# Altium project obc-db.PrjPcb
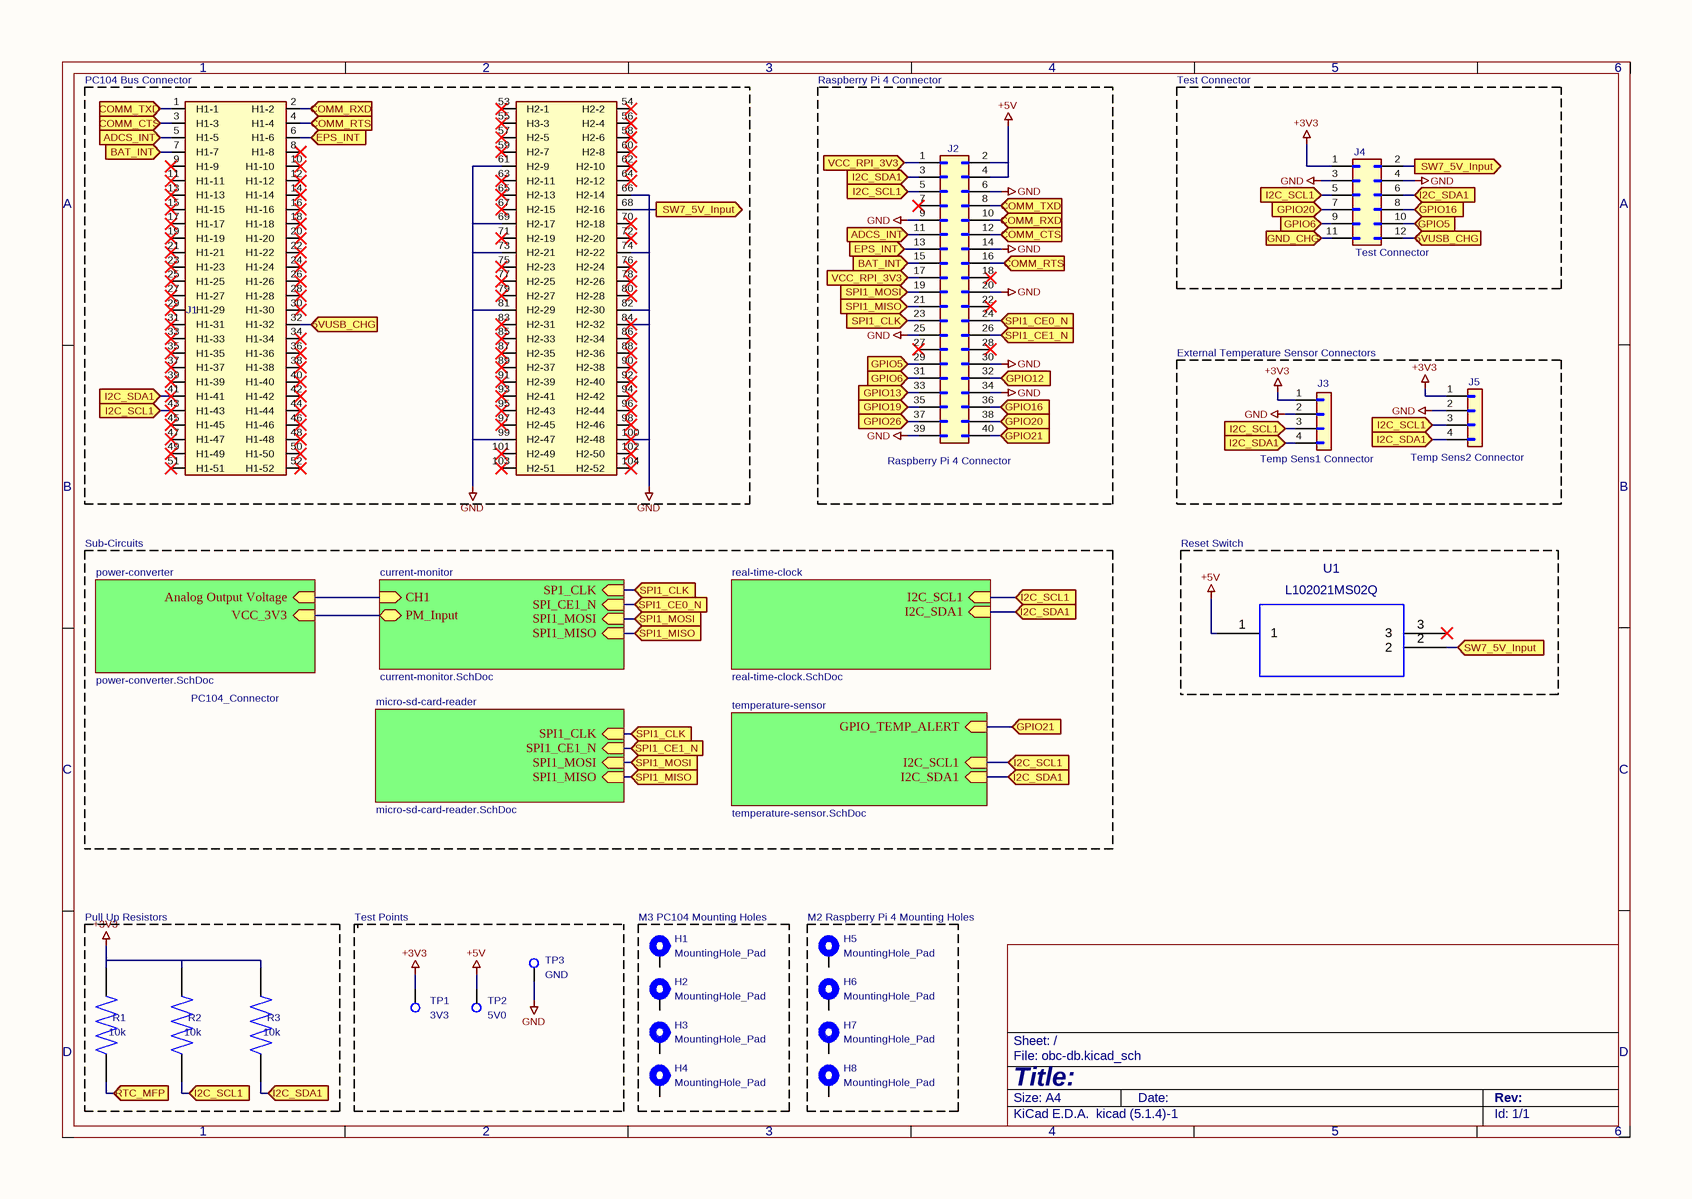
[diagram p0: obc-db.SchDoc]
6 sheets, 55 parts. Net scope: hierarchical (ports join the sheet entries above them; power ports are global).
Board files: obc-db.PcbDoc, obc-db(1).PcbDoc
Sheets:
  obc-db.SchDoc
    micro-sd-card-reader = micro-sd-card-reader.SchDoc
    power-converter = power-converter.SchDoc
    current-monitor = current-monitor.SchDoc
    real-time-clock = real-time-clock.SchDoc
    temperature-sensor = temperature-sensor.SchDoc

## Sheet obc-db.SchDoc
size 297 x 209 mm

### Parts
H1  MountingHole_Pad  [MountingHole_3.2mm_M3_Pad_TopBottom]
H2  MountingHole_Pad  [MountingHole_3.2mm_M3_Pad_TopBottom]
H3  MountingHole_Pad  [MountingHole_3.2mm_M3_Pad_TopBottom]
H4  MountingHole_Pad  [MountingHole_3.2mm_M3_Pad_TopBottom]
H5  MountingHole_Pad  [MountingHole_2.2mm_M2_Pad_TopBottom]
H6  MountingHole_Pad  [MountingHole_2.2mm_M2_Pad_TopBottom]
H7  MountingHole_Pad  [MountingHole_2.2mm_M2_Pad_TopBottom]
H8  MountingHole_Pad  [MountingHole_2.2mm_M2_Pad_TopBottom]
J1  PC104_Connector  [pc104-connector]
J2  Raspberry Pi 4 Connector  [PinSocket_2x20_P2.54mm_Vertical]
J3  Temp Sens1 Connector  [PinHeader_1x04_P2.54mm_Vertical]
J4  Test Connector  [PinSocket_2x06_P2.54mm_Horizontal]
J5  Temp Sens2 Connector  [PinHeader_1x04_P2.54mm_Vertical]
R1  10k  [R_0603_1608Metric]
R2  10k  [R_0603_1608Metric]
R3  10k  [R_0603_1608Metric]
TP1  3V3  [TestPoint_Pad_2.0x2.0mm]
TP2  5V0  [TestPoint_Pad_2.0x2.0mm]
TP3  GND  [TestPoint_Pad_2.0x2.0mm]
U1  L102021MS02Q  [L102021MS02Q]

### Blocks framed on the sheet
PC104 Bus Connector: J1
Test Connector: J4
External Temperature Sensor Connectors /: J3 J5
Reset Switch: U1
Pull Up Resistors: R1-R3
Test Points: TP1-TP3
M3 PC104 Mounting Holes /: H1-H4
M2 Raspberry Pi 4 Mounting Holes /: H5-H8

### Sub-sheets
current-monitor = current-monitor.SchDoc: CH1 (in), SPI1_MISO (in), SPI1_MOSI (in), SPI_CE1_N (in), SP1_CLK (in), PM_Input (bidir)
micro-sd-card-reader = micro-sd-card-reader.SchDoc: SPI1_CLK (in), SPI1_MOSI (in), SPI1_MISO (in), SPI1_CE1_N (in)
power-converter = power-converter.SchDoc: Analog Output Voltage (in), VCC_3V3 (in)
real-time-clock = real-time-clock.SchDoc: I2C_SCL1 (in), I2C_SDA1 (in)
temperature-sensor = temperature-sensor.SchDoc: GPIO_TEMP_ALERT (in), I2C_SDA1 (in), I2C_SCL1 (in)

### Ports
5VUSB_CHG (in), ADCS_INT (in), BAT_INT (in), COMM_CTS (in), COMM_RTS (in), COMM_RXD (in), COMM_TXD (in), EPS_INT (in), GND_CHG (in), GPIO5 (in), GPIO6 (in), GPIO12 (in), GPIO13 (in), GPIO16 (in), GPIO19 (in), GPIO20 (in), GPIO21 (in), GPIO26 (in), I2C_SCL1 (in), I2C_SDA1 (in), RTC_MFP (in), SPI1_CE0_N (in), SPI1_CE1_N (in), SPI1_CLK (in), SPI1_MISO (in), SPI1_MOSI (in), SW7_5V_Input (in), SW7_5V_Input (out), VCC_RPI_3V3 (in)

### Nets
+3V3: J3.1(Pin_1) J4.1(Pin_1) J5.1(Pin_1) R1.1 R2.1 R3.1 TP1.1
+5V: J2.2(Pin_2) J2.4(Pin_4) TP2.1 U1.1
GND: J1.61(H2-9) J1.66(H2-14) J1.69(H2-17) J1.73(H2-21) J1.74(H2-22) J1.81(H2-29) J1.82(H2-30) J1.84(H2-32) J1.99(H2-47) J1.100(H2-48) J2.6(Pin_6) J2.9(Pin_9) J2.14(Pin_14) J2.20(Pin_20) J2.25(Pin_25) J2.30(Pin_30) J2.34(Pin_34) J2.39(Pin_39) J3.2(Pin_2) J4.3(Pin_3) J4.4(Pin_4) J5.2(Pin_2) TP3.1
5VUSB_CHG: J1.32(H1-32) J4.12(Pin_12) ; port 5VUSB_CHG
ADCS_INT: J1.5(H1-5) J2.11(Pin_11) ; port ADCS_INT
Analog Output Voltage: sheet power-converter/Analog Output Voltage, sheet current-monitor/CH1
BAT_INT: J1.7(H1-7) J2.15(Pin_15) ; port BAT_INT
COMM_CTS: J1.3(H1-3) J2.12(Pin_12) ; port COMM_CTS
COMM_RTS: J1.4(H1-4) J2.16(Pin_16) ; port COMM_RTS
COMM_RXD: J1.2(H1-2) J2.10(Pin_10) ; port COMM_RXD
COMM_TXD: J1.1(H1-1) J2.8(Pin_8) ; port COMM_TXD
EPS_INT: J1.6(H1-6) J2.13(Pin_13) ; port EPS_INT
GND_CHG: J4.11(Pin_11) ; port GND_CHG
GPIO5: J2.29(Pin_29) J4.10(Pin_10) ; port GPIO5
GPIO6: J2.31(Pin_31) J4.9(Pin_9) ; port GPIO6
GPIO12: J2.32(Pin_32) ; port GPIO12
GPIO13: J2.33(Pin_33) ; port GPIO13
GPIO16: J2.36(Pin_36) J4.8(Pin_8) ; port GPIO16
GPIO19: J2.35(Pin_35) ; port GPIO19
GPIO20: J2.38(Pin_38) J4.7(Pin_7) ; port GPIO20
GPIO21: J2.40(Pin_40) ; port GPIO21, sheet temperature-sensor/GPIO_TEMP_ALERT
GPIO26: J2.37(Pin_37) ; port GPIO26
I2C_SCL1: J1.43(H1-43) J2.5(Pin_5) J3.3(Pin_3) J4.5(Pin_5) J5.3(Pin_3) R2.2 ; port I2C_SCL1, sheet real-time-clock/I2C_SCL1, sheet temperature-sensor/I2C_SCL1
I2C_SDA1: J1.41(H1-41) J2.3(Pin_3) J3.4(Pin_4) J4.6(Pin_6) J5.4(Pin_4) R3.2 ; port I2C_SDA1, sheet real-time-clock/I2C_SDA1, sheet temperature-sensor/I2C_SDA1
PM_Input: sheet power-converter/VCC_3V3, sheet current-monitor/PM_Input
RTC_MFP: R1.2 ; port RTC_MFP
SP1_CLK: J2.23(Pin_23) ; port SPI1_CLK, sheet micro-sd-card-reader/SPI1_CLK, sheet current-monitor/SP1_CLK
SPI1_CE0_N: J2.24(Pin_24) ; port SPI1_CE0_N, sheet current-monitor/SPI_CE1_N
SPI1_CE1_N: J2.26(Pin_26) ; port SPI1_CE1_N, sheet micro-sd-card-reader/SPI1_CE1_N
SPI1_MISO: J2.21(Pin_21) ; port SPI1_MISO, sheet micro-sd-card-reader/SPI1_MISO, sheet current-monitor/SPI1_MISO
SPI1_MOSI: J2.19(Pin_19) ; port SPI1_MOSI, sheet micro-sd-card-reader/SPI1_MOSI, sheet current-monitor/SPI1_MOSI
SW7_5V_Input: J1.68(H2-16) J4.2(Pin_2) U1.2 ; port SW7_5V_Input
VCC_RPI_3V3: J2.1(Pin_1) J2.17(Pin_17) ; port VCC_RPI_3V3

Not connected (* = marked no-connect by the designer): H1 1; H2 1; H3 1; H4 1; H5 1; H6 1; H7 1; H8 1; J1 8(H1-8)* 9(H1-9)* 10(H1-10)* 11(H1-11)* 12(H1-12)* 13(H1-13)* 14(H1-14)* 15(H1-15)* 16(H1-16)* 17(H1-17)* 18(H1-18)* 19(H1-19)* 20(H1-20)* 21(H1-21)* 22(H1-22)* 23(H1-23)* 24(H1-24)* 25(H1-25)* 26(H1-26)* 27(H1-27)* 28(H1-28)* 29(H1-29)* 30(H1-30)* 31(H1-31)* 33(H1-33)* 34(H1-34)* 35(H1-35)* 36(H1-36)* 37(H1-37)* 38(H1-38)* 39(H1-39)* 40(H1-40)* 42(H1-42)* 44(H1-44)* 45(H1-45)* 46(H1-46)* 47(H1-47)* 48(H1-48)* 49(H1-49)* 50(H1-50)* 51(H1-51)* 52(H1-52)* 53(H2-1)* 54(H2-2)* 55(H3-3)* 56(H2-4)* 57(H2-5)* 58(H2-6)* 59(H2-7)* 60(H2-8)* 62(H2-10)* 63(H2-11)* 64(H2-12)* 65(H2-13)* 67(H2-15)* 70(H2-18)* 71(H2-19)* 72(H2-20)* 75(H2-23)* 76(H2-24)* 77(H2-25)* 78(H2-26)* 79(H2-27)* 80(H2-28)* 83(H2-31)* 85(H2-33)* 86(H2-34)* 87(H2-35)* 88(H2-36)* 89(H2-37)* 90(H2-38)* 91(H2-39)* 92(H2-40)* 93(H2-41)* 94(H2-42)* 95(H2-43)* 96(H2-44)* 97(H2-45)* 98(H2-46)* 101(H2-49)* 102(H2-50)* 103(H2-51)* 104(H2-52)*; J2 7(Pin_7)* 18(Pin_18)* 22(Pin_22)* 27(Pin_27)* 28(Pin_28)*; U1 3*

### Notes on the sheet
- Raspberry Pi 4 Connector
- Sub-Circuits
- 1
- 2
- 3
- 4
- 5
- 6
- A
- B
- C
- D
- Title:
- File: obc-db.kicad_sch
- Sheet: /
- KiCad E.D.A.  kicad (5.1.4)-1
- Size: A4
- Date:
- Rev:
- Id: 1/1

### Library data of the parts
J1 = pc104-connector: Value: PC104_Connector; Footprint: pc104-template:pc104-connector
J2 = Conn_02x20_Odd_Even: Value: Raspberry Pi 4 Connector; Footprint: Connector_PinSocket_2.54mm:PinSocket_2x20_P2.54mm_Vertical
J3 J5 = Conn_01x04: Footprint: Connector_PinHeader_2.54mm:PinHeader_1x04_P2.54mm_Vertical
  J3: Value: Temp Sens1 Connector
  J5: Value: Temp Sens2 Connector
J4 = Conn_02x06_Odd_Even: Value: Test Connector; Footprint: Connector_PinSocket_2.54mm:PinSocket_2x06_P2.54mm_Horizontal
R1-R3 = ESR03EZPF1002: Value: 10k; Footprint: Resistor_SMD:R_0603_1608Metric
TP1-TP3 = TestPoint: Footprint: TestPoint:TestPoint_Pad_2.0x2.0mm
  TP1: Value: 3V3
  TP2: Value: 5V0
  TP3: Value: GND
H1-H8 = MountingHole_Pad: Value: MountingHole_Pad
  H1-H4: Footprint: MountingHole:MountingHole_3.2mm_M3_Pad_TopBottom
  H5-H8: Footprint: MountingHole:MountingHole_2.2mm_M2_Pad_TopBottom
U1 = L102021MS02Q: Value: L102021MS02Q; Footprint: qset-footprints:L102021MS02Q

## Sheet micro-sd-card-reader.SchDoc
size 297 x 209 mm
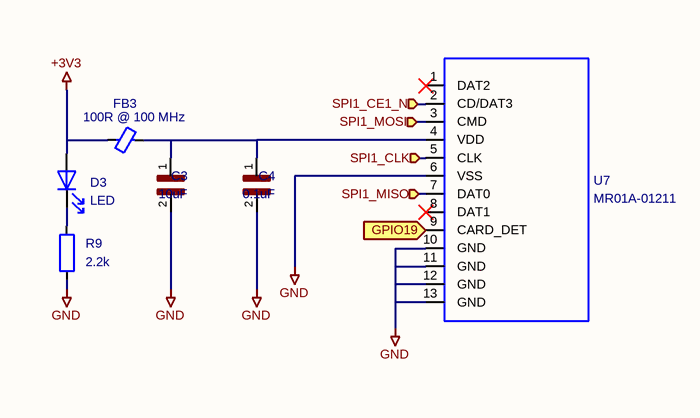
[diagram p1: micro-sd-card-reader.SchDoc]

### Parts
C3  10uF  [C_0603_1608Metric]
C4  0.1uF  [C_0603_1608Metric]
D3  LED  [LED_0603_1608Metric]
FB3  100R @ 100 MHz  [L_0603_1608Metric]
R9  2.2k  [R_0603_1608Metric]
U7  MR01A-01211  [MR01A-01211]

### Ports
GPIO19 (in), SPI1_CE1_N (in), SPI1_CLK (in), SPI1_MISO (in), SPI1_MOSI (in)

### Nets
+3V3: D3.2(A) FB3.1
GND: C3.2 C4.2 R9.2 U7.6(VSS) U7.10(GND) U7.11(GND) U7.12(GND) U7.13(GND)
GPIO19: U7.9(CARD_DET) ; port GPIO19
SP1_CLK: U7.5(CLK) ; port SPI1_CLK
SPI1_CE1_N: U7.2(CD/DAT3) ; port SPI1_CE1_N
SPI1_MISO: U7.7(DAT0) ; port SPI1_MISO
SPI1_MOSI: U7.3(CMD) ; port SPI1_MOSI
NetC3_1: C3.1 C4.1 FB3.2 U7.4(VDD)
NetD3_1: D3.1(K) R9.1

Not connected (* = marked no-connect by the designer): U7 1(DAT2)* 8(DAT1)*

### Notes on the sheet
- 1
- 2
- 3
- 4
- 5
- 6
- A
- B
- C
- D
- Title:
- File: micro-sd-card-reader.kicad_sch
- Sheet: /
- KiCad E.D.A.  kicad (5.1.4)-1
- Size: A4
- Date:
- Rev:
- Id: 1/1

### Library data of the parts
C3 C4 = CL10B104KB8NNNL: Footprint: Capacitor_SMD:C_0603_1608Metric
  C3: Value: 10uF
  C4: Value: 0.1uF
FB3 = FerriteBead_Small: Value: 100R @ 100 MHz; Footprint: Inductor_SMD:L_0603_1608Metric
R9 = R: Value: 2.2k; Footprint: Resistor_SMD:R_0603_1608Metric
D3 = LED: Value: LED; Footprint: LED_SMD:LED_0603_1608Metric
U7 = MR01A-01211: Value: MR01A-01211; Footprint: qset-footprints:MR01A-01211

## Sheet power-converter.SchDoc
size 297 x 209 mm
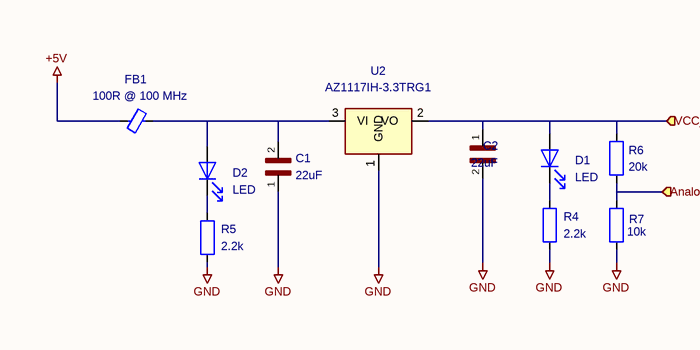
[diagram p2: power-converter.SchDoc]

### Parts
C1  22uF  [C_0603_1608Metric]
C2  22uF  [C_0603_1608Metric]
D1  LED  [LED_0603_1608Metric]
D2  LED  [LED_0603_1608Metric]
FB1  100R @ 100 MHz  [L_0603_1608Metric]
R4  2.2k  [R_0603_1608Metric]
R5  2.2k  [R_0603_1608Metric]
R6  20k  [R_0603_1608Metric]
R7  10k  [R_0603_1608Metric]
U2  AZ1117IH-3.3TRG1  [SOT-223-3_TabPin2]

### Ports
Analog Output Voltage (in), VCC_3V3 (in)

### Nets
+5V: FB1.2
GND: C1.1 C2.2 R4.2 R5.2 R7.2 U2.1(GND)
Analog Output Voltage: R6.2 R7.1 ; port Analog Output Voltage
PM_Input: C2.1 D1.2(A) R6.1 U2.2(VO) ; port VCC_3V3
NetC1_2: C1.2 D2.2(A) FB1.1 U2.3(VI)
NetD1_1: D1.1(K) R4.1
NetD2_1: D2.1(K) R5.1

### Notes on the sheet
- 1
- 2
- 3
- 4
- 5
- 6
- A
- B
- C
- D
- Title:
- File: power-converter.kicad_sch
- Sheet: /
- KiCad E.D.A.  kicad (5.1.4)-1
- Size: A4
- Date:
- Rev:
- Id: 1/1

### Library data of the parts
C1 C2 = CL10B104KB8NNNL: Value: 22uF; Footprint: Capacitor_SMD:C_0603_1608Metric
FB1 = FerriteBead_Small: Value: 100R @ 100 MHz; Footprint: Inductor_SMD:L_0603_1608Metric
R4-R7 = R: Footprint: Resistor_SMD:R_0603_1608Metric
  R4 R5: Value: 2.2k
  R6: Value: 20k
  R7: Value: 10k
U2 = AZ1117-3.3: Value: AZ1117IH-3.3TRG1; Footprint: Package_TO_SOT_SMD:SOT-223-3_TabPin2
D1 D2 = LED: Value: LED; Footprint: LED_SMD:LED_0603_1608Metric

## Sheet current-monitor.SchDoc
size 297 x 209 mm
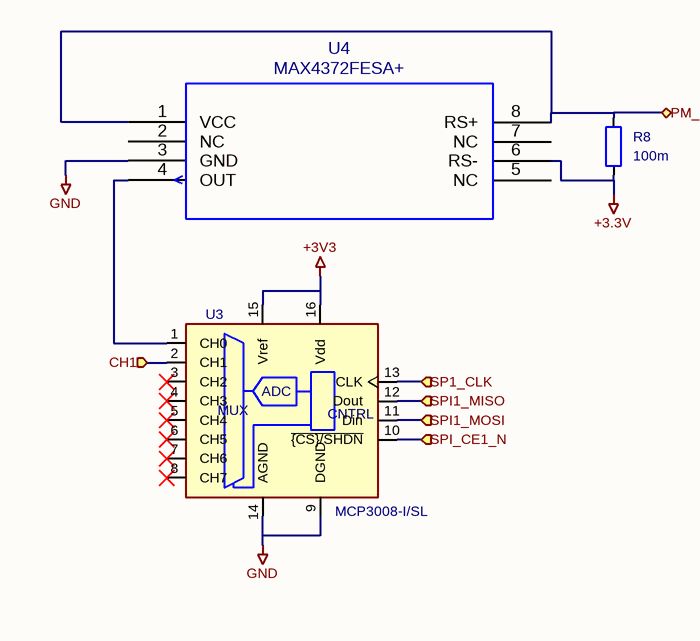
[diagram p3: current-monitor.SchDoc]

### Parts
R8  100m  [R_0402_1005Metric]
U3  MCP3008-I/SL  [Microchip-MCP3008-I_SL-Level_A]
U4  MAX4372FESA+  [Maxim-MAX4372FESA+-Level_A]

### Ports
CH1 (in), PM_Input (bidir), SP1_CLK (in), SPI1_MISO (in), SPI1_MOSI (in), SPI_CE1_N (in)

### Nets
+3.3V: R8.2 U4.6(RS-)
+3V3: U3.15(Vref) U3.16(Vdd)
GND: U3.9(DGND) U3.14(AGND) U4.3(GND)
Analog Output Voltage: U3.2(CH1) ; port CH1
PM_Input: R8.1 U4.1(VCC) U4.8(RS+) ; port PM_Input
SP1_CLK: U3.13(CLK) ; port SP1_CLK
SPI1_CE0_N: U3.10(~{{CS}/SHDN}) ; port SPI_CE1_N
SPI1_MISO: U3.12(Dout) ; port SPI1_MISO
SPI1_MOSI: U3.11(Din) ; port SPI1_MOSI
NetU3_1: U3.1(CH0) U4.4(OUT)

Not connected (* = marked no-connect by the designer): U3 3(CH2)* 4(CH3)* 5(CH4)* 6(CH5)* 7(CH6)* 8(CH7)*; U4 2(NC) 5(NC) 7(NC)

### Notes on the sheet
- 1
- 2
- 3
- 4
- 5
- 6
- A
- B
- C
- D
- Title:
- File: current-monitor.kicad_sch
- Sheet: /
- KiCad E.D.A.  kicad (5.1.4)-1
- Size: A4
- Date:
- Rev:
- Id: 1/1
- (in symbol MCP3008) ADC; MUX; CNTRL

### Library data of the parts
R8 = R: Value: 100m; Footprint: Resistor_SMD:R_0402_1005Metric
U3 = MCP3008: Value: MCP3008-I/SL; Footprint: qset-footprints:Microchip-MCP3008-I_SL-Level_A
U4 = MAX4372FESA+-MAX4372FESA+: Value: MAX4372FESA+; Footprint: qset-footprints:Maxim-MAX4372FESA+-Level_A

## Sheet real-time-clock.SchDoc
size 297 x 209 mm
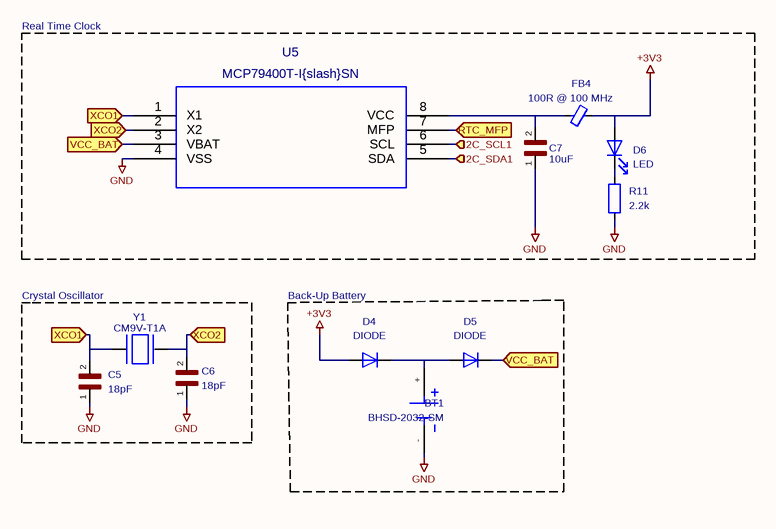
[diagram p4: real-time-clock.SchDoc]

### Parts
BT1  BHSD-2032-SM  [BAT_BHSD-2032-SM]
C5  18pF  [C_0603_1608Metric]
C6  18pF  [C_0603_1608Metric]
C7  10uF  [C_0603_1608Metric]
D4  DIODE  [D_0603_1608Metric]
D5  DIODE  [D_0603_1608Metric]
D6  LED  [LED_0603_1608Metric]
FB4  100R @ 100 MHz  [L_0603_1608Metric]
R11  2.2k  [R_0603_1608Metric]
U5  MCP79400T-I{slash}SN  [MCP79400T-I&slash_SN]
Y1  CM9V-T1A  [XTAL_CM9V-T1A-32.768KHZ-9PF-20PPM-TA-QC]

### Blocks framed on the sheet
Real Time Clock: C7 D6 FB4 R11 U5
Crystal Oscillator: C5 C6 Y1

### Ports
I2C_SCL1 (in), I2C_SDA1 (in), RTC_MFP (in), VCC_BAT (in), XCO1 (in), XCO2 (in)

### Nets
+3V3: D4.1(A) D6.2(A) FB4.1
GND: BT1.- C5.1 C6.1 C7.1 R11.2 U5.4(VSS)
I2C_SCL1: U5.6(SCL) ; port I2C_SCL1
I2C_SDA1: U5.5(SDA) ; port I2C_SDA1
RTC_MFP: U5.7(MFP) ; port RTC_MFP
VCC_BAT: D5.2(K) U5.3(VBAT) ; port VCC_BAT
XCO1: C5.2 U5.1(X1) Y1.1 ; port XCO1
XCO2: C6.2 U5.2(X2) Y1.2 ; port XCO2
NetBT1_+: BT1.+ D4.2(K) D5.1(A)
NetC7_2: C7.2 FB4.2 U5.8(VCC)
NetD6_1: D6.1(K) R11.1

### Notes on the sheet
- Back-Up Battery
- 1
- 2
- 3
- 4
- 5
- 6
- A
- B
- C
- D
- Title:
- File: real-time-clock.kicad_sch
- Sheet: /
- KiCad E.D.A.  kicad (5.1.4)-1
- Size: A4
- Date:
- Rev:
- Id: 1/1

### Library data of the parts
BT1 = BVSD-2032-PC: MANUFACTURER: Memory Protection Devices, Inc.; MAXIMUM_PACKAGE_HEIGHT: 28.19 mm; STANDARD: Manufacturer Recommendations; PARTREV: D; Value: BHSD-2032-SM; Footprint: qset-footprints:BAT_BHSD-2032-SM
C5-C7 = CL10B104KB8NNNL: Footprint: Capacitor_SMD:C_0603_1608Metric
  C5 C6: Value: 18pF
  C7: Value: 10uF
FB4 = FerriteBead_Small: Value: 100R @ 100 MHz; Footprint: Inductor_SMD:L_0603_1608Metric
R11 = R: Value: 2.2k; Footprint: Resistor_SMD:R_0603_1608Metric
U5 = MCP79400T-I{brace}slash}SN: Value: MCP79400T-I{slash}SN; Footprint: qset-footprints:MCP79400T-I&slash_SN
Y1 = CM9V-T1A-32.768KHZ-9PF-20PPM-TA-QC: MANUFACTURER: Micro Crystal; PARTREV: 8.0/10.2016; STANDARD: Manufacturer Recommendations; MAXIMUM_PACKAGE_HEIGHT: 0.5 mm; Value: CM9V-T1A; Footprint: qset-footprints:XTAL_CM9V-T1A-32.768KHZ-9PF-20PPM-TA-QC
D4 D5 = DIODE: Spice_Netlist_Enabled: Y; Spice_Primitive: D; Value: DIODE; Footprint: Diode_SMD:D_0603_1608Metric
D6 = LED: Value: LED; Footprint: LED_SMD:LED_0603_1608Metric

## Sheet temperature-sensor.SchDoc
size 297 x 209 mm
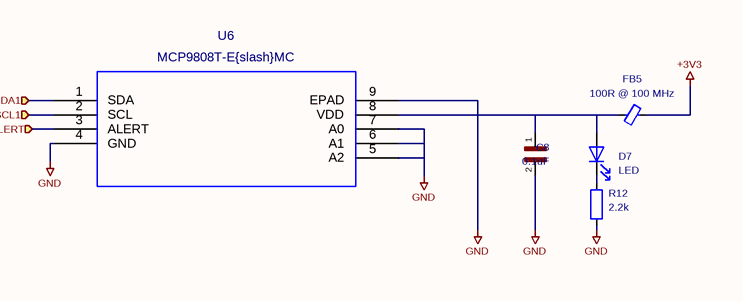
[diagram p5: temperature-sensor.SchDoc]

### Parts
C8  0.1uF  [C_0603_1608Metric]
D7  LED  [LED_0603_1608Metric]
FB5  100R @ 100 MHz  [L_0603_1608Metric]
R12  2.2k  [R_0603_1608Metric]
U6  MCP9808T-E{slash}MC  [MCP9808T-E&slash_MC]

### Ports
GPIO_TEMP_ALERT (in), I2C_SCL1 (in), I2C_SDA1 (in)

### Nets
+3V3: FB5.1
GND: C8.2 R12.2 U6.4(GND) U6.5(A2) U6.6(A1) U6.7(A0) U6.9(EPAD)
GPIO21: U6.3(ALERT) ; port GPIO_TEMP_ALERT
I2C_SCL1: U6.2(SCL) ; port I2C_SCL1
I2C_SDA1: U6.1(SDA) ; port I2C_SDA1
NetC8_1: C8.1 D7.2(A) FB5.2 U6.8(VDD)
NetD7_1: D7.1(K) R12.1

### Notes on the sheet
- 1
- 2
- 3
- 4
- 5
- 6
- A
- B
- C
- D
- Title:
- File: temperature-sensor.kicad_sch
- Sheet: /
- KiCad E.D.A.  kicad (5.1.4)-1
- Size: A4
- Date:
- Rev:
- Id: 1/1

### Library data of the parts
C8 = CL10B104KB8NNNL: Value: 0.1uF; Footprint: Capacitor_SMD:C_0603_1608Metric
FB5 = FerriteBead_Small: Value: 100R @ 100 MHz; Footprint: Inductor_SMD:L_0603_1608Metric
R12 = R: Value: 2.2k; Footprint: Resistor_SMD:R_0603_1608Metric
U6 = MCP9808T-E{brace}slash}MC: Value: MCP9808T-E{slash}MC; Footprint: qset-footprints:MCP9808T-E&slash_MC
D7 = LED: Value: LED; Footprint: LED_SMD:LED_0603_1608Metric

## Nets that join several sheets
+3V3: obc-db (7 pins), micro-sd-card-reader (D3.2 FB3.1), current-monitor (U3.15 U3.16), real-time-clock (D4.1 D6.2 FB4.1), temperature-sensor (FB5.1)
+5V: obc-db (J2.2 J2.4 TP2.1 U1.1), power-converter (FB1.2)
GND: obc-db (23 pins), micro-sd-card-reader (8 pins), power-converter (6 pins), current-monitor (U3.9 U3.14 U4.3), real-time-clock (6 pins), temperature-sensor (7 pins)
Analog Output Voltage: power-converter (R6.2 R7.1), current-monitor (U3.2)
GPIO21: obc-db (J2.40), temperature-sensor (U6.3)
I2C_SCL1: obc-db (6 pins), real-time-clock (U5.6), temperature-sensor (U6.2)
I2C_SDA1: obc-db (6 pins), real-time-clock (U5.5), temperature-sensor (U6.1)
PM_Input: power-converter (C2.1 D1.2 R6.1 U2.2), current-monitor (R8.1 U4.1 U4.8)
SP1_CLK: obc-db (J2.23), micro-sd-card-reader (U7.5), current-monitor (U3.13)
SPI1_CE0_N: obc-db (J2.24), current-monitor (U3.10)
SPI1_CE1_N: obc-db (J2.26), micro-sd-card-reader (U7.2)
SPI1_MISO: obc-db (J2.21), micro-sd-card-reader (U7.7), current-monitor (U3.12)
SPI1_MOSI: obc-db (J2.19), micro-sd-card-reader (U7.3), current-monitor (U3.11)